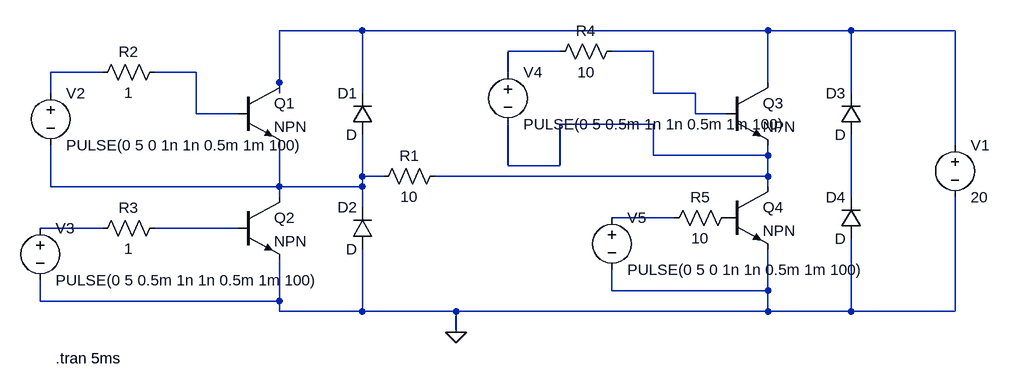
[diagram p0: schematic FullWaveInverter_R.asc]
FullWaveInverter_R.asc, the LTspice schematic file:
Version 4
SHEET 1 956 680
WIRE -16 64 -144 64
WIRE 608 64 -16 64
WIRE 736 64 608 64
WIRE 896 64 736 64
WIRE 288 96 208 96
WIRE 432 96 368 96
WIRE -416 128 -496 128
WIRE -272 128 -336 128
WIRE 208 128 208 96
WIRE -144 144 -144 64
WIRE 608 144 608 64
WIRE -496 160 -496 128
WIRE -144 160 -144 144
WIRE -16 160 -16 64
WIRE 432 160 432 96
WIRE 496 160 432 160
WIRE 736 160 736 64
WIRE -272 192 -272 128
WIRE -208 192 -272 192
WIRE 496 192 496 160
WIRE 544 192 496 192
WIRE 432 208 288 208
WIRE 896 240 896 64
WIRE 432 256 432 208
WIRE 608 256 608 240
WIRE 608 256 432 256
WIRE 208 272 208 208
WIRE 288 272 288 208
WIRE 288 272 208 272
WIRE -16 288 -16 224
WIRE 16 288 -16 288
WIRE 608 288 608 256
WIRE 608 288 96 288
WIRE -496 304 -496 240
WIRE -144 304 -144 240
WIRE -144 304 -496 304
WIRE -16 304 -16 288
WIRE -16 304 -144 304
WIRE 608 304 608 288
WIRE -144 320 -144 304
WIRE 736 320 736 224
WIRE -16 336 -16 304
WIRE 464 352 368 352
WIRE -416 368 -512 368
WIRE -208 368 -336 368
WIRE 368 464 368 432
WIRE 608 464 608 400
WIRE 608 464 368 464
WIRE -512 480 -512 448
WIRE -144 480 -144 416
WIRE -144 480 -512 480
WIRE -144 496 -144 480
WIRE -16 496 -16 400
WIRE -16 496 -144 496
WIRE 128 496 -16 496
WIRE 608 496 608 464
WIRE 608 496 128 496
WIRE 736 496 736 384
WIRE 736 496 608 496
WIRE 896 496 896 320
WIRE 896 496 736 496
WIRE 128 528 128 496
FLAG 128 528 0
SYMBOL diode 0 224 R180
WINDOW 0 24 64 Left 2
WINDOW 3 24 0 Left 2
SYMATTR InstName D1
SYMBOL diode 0 400 R180
WINDOW 0 24 64 Left 2
WINDOW 3 24 0 Left 2
SYMATTR InstName D2
SYMBOL diode 752 224 R180
WINDOW 0 24 64 Left 2
WINDOW 3 24 0 Left 2
SYMATTR InstName D3
SYMBOL diode 752 384 R180
WINDOW 0 24 64 Left 2
WINDOW 3 24 0 Left 2
SYMATTR InstName D4
SYMBOL npn -208 144 R0
SYMATTR InstName Q1
SYMBOL npn -208 320 R0
SYMATTR InstName Q2
SYMBOL npn 544 144 R0
SYMATTR InstName Q3
SYMBOL npn 544 304 R0
SYMATTR InstName Q4
SYMBOL res 112 272 R90
WINDOW 0 0 56 VBottom 2
WINDOW 3 32 56 VTop 2
SYMATTR InstName R1
SYMATTR Value 10
SYMBOL voltage 896 224 R0
SYMATTR InstName V1
SYMATTR Value 20
SYMBOL voltage -496 144 R0
SYMATTR InstName V2
SYMATTR Value PULSE(0 5 0 1n 1n 0.5m 1m 100)
SYMBOL voltage -512 352 R0
SYMATTR InstName V3
SYMATTR Value PULSE(0 5 0.5m 1n 1n 0.5m 1m 100)
SYMBOL res -320 112 R90
WINDOW 0 0 56 VBottom 2
WINDOW 3 32 56 VTop 2
SYMATTR InstName R2
SYMATTR Value 1
SYMBOL res -432 384 R270
WINDOW 0 32 56 VTop 2
WINDOW 3 0 56 VBottom 2
SYMATTR InstName R3
SYMATTR Value 1
SYMBOL voltage 208 112 R0
SYMATTR InstName V4
SYMATTR Value PULSE(0 5 0.5m 1n 1n 0.5m 1m 100)
SYMBOL res 384 80 R90
WINDOW 0 0 56 VBottom 2
WINDOW 3 32 56 VTop 2
SYMATTR InstName R4
SYMATTR Value 10
SYMBOL voltage 368 336 R0
SYMATTR InstName V5
SYMATTR Value PULSE(0 5 0 1n 1n 0.5m 1m 100)
SYMBOL res 448 368 R270
WINDOW 0 32 56 VTop 2
WINDOW 3 0 56 VBottom 2
SYMATTR InstName R5
SYMATTR Value 10
TEXT -488 568 Left 2 !.tran 5ms

The netlist it stands for:
* FullWaveInverter_R.asc
D1 N007 N001 D
D2 0 N007 D
D3 N008 N001 D
D4 0 N008 D
Q1 N001 N005 N007 0 NPN
Q2 N007 N011 0 0 NPN
Q3 N001 N003 N006 0 NPN
Q4 N006 P001 0 0 NPN
R1 N006 N007 10
V1 N001 0 20
V2 N004 N007 PULSE(0 5 0 1n 1n 0.5m 1m 100)
V3 N010 0 PULSE(0 5 0.5m 1n 1n 0.5m 1m 100)
R2 N005 N004 1
R3 N010 N011 1
V4 N002 N006 PULSE(0 5 0.5m 1n 1n 0.5m 1m 100)
R4 N003 N002 10
V5 N009 0 PULSE(0 5 0 1n 1n 0.5m 1m 100)
R5 N009 P001 10
.model D D
.lib standard.dio
.model NPN NPN
.model PNP PNP
.lib standard.bjt
.tran 5ms
.backanno
.end